# EAGLE design Base-Rev0 (EAGLE 7.7.0)
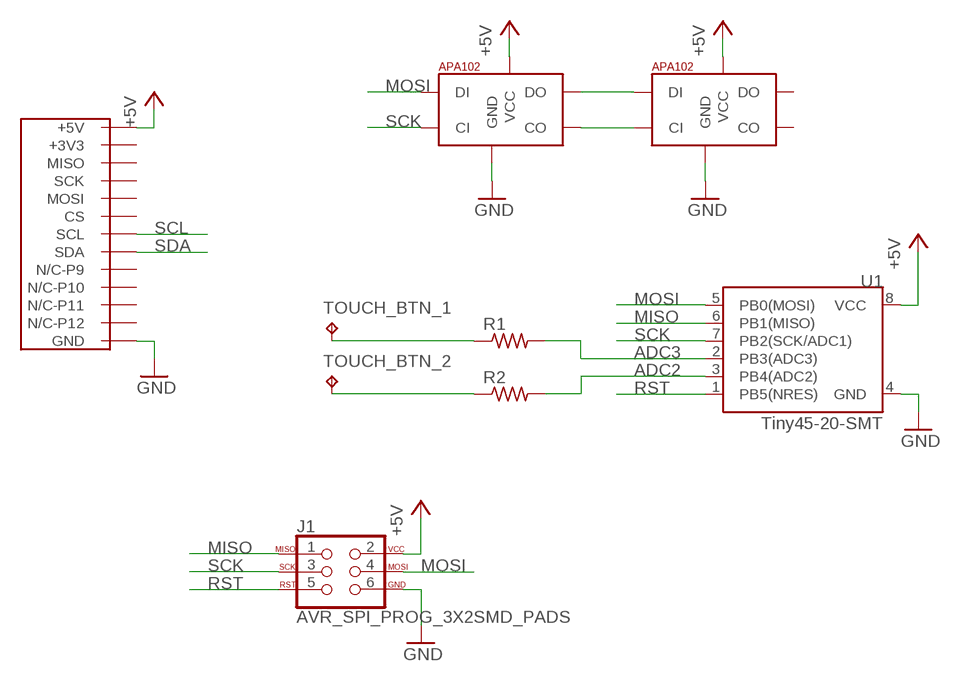
[diagram p0: schematic, sheet 1]

## Parts
J1  AVR_SPI_PROG_3X2SMD_PADS  [2X3-SMD-PADS]
R1  R-US_M0805  [M0805]
R2  R-US_M0805  [M0805]
TOUCH_BTN_1  TPTP06R  [TP06R]
TOUCH_BTN_2  TPTP06R  [TP06R]
U1  Tiny45-20-SMT  ATTINY45TINY45-20-SMT  [SO08-EIAJ_MCU]
U2  APA1025050  [APA102_5050]
U3  APA1025050  [APA102_5050]
U$1  BADGE64EXAMPLE  [BADGE64-MINIBADGE]

## Nets
+5V: J1.2 U1.8(VCC) U2.1(VCC) U3.1(VCC) U$1.+5V
ADC2: R2.2 U1.3(PB4(ADC2))
ADC3: R1.2 U1.2(PB3(ADC3))
BTN2: R2.1 TOUCH_BTN_2.TP
GND: J1.6 U1.4(GND) U2.6(GND) U3.6(GND) U$1.GND-P2(GND) U$1.GND-P8(GND) U$1.GND-P16(GND)
MISO: J1.1 U1.6(PB1(MISO))
MOSI: J1.4 U1.5(PB0(MOSI)) U2.4(DI)
N$1: U2.2(CO) U3.5(CI)
N$2: U2.3(DO) U3.4(DI)
N$4: R1.1 TOUCH_BTN_1.TP
RST: J1.5 U1.1(PB5(NRES))
SCK: J1.3 U1.7(PB2(SCK/ADC1)) U2.5(CI)
SCL: U$1.SCL
SDA: U$1.SDA
Unconnected: U3.2(CO) U3.3(DO) U$1.CS U$1.MISO U$1.MOSI U$1.NC-P9(N/C-P9) U$1.NC-P10(N/C-P10) U$1.NC-P11(N/C-P11) U$1.NC-P12(N/C-P12) U$1.SCK

## Power pins joined to a net without a drawn wire
+3V3: U$1.+3V3-P7(+3V3) U$1.+3V3-P15(+3V3)

## Library data of the parts
J1 = SparkFun-Connectors:AVR_SPI_PROG_3X2: AVR ISP 6 Pin This is the reduced ISP connector for AVR programming. Common on Arduino. This footprint will take up less PCB space and can be used with a 10-pin to 6-pin adapter such as SKU: BOB-08508 **Special note about "TEST_POINT" package. The stop mask is on the top side, so if you want your programming test points to be on the bottom of your board, make sure to place this package on the bottom side of the board. This also ensure that the orientation to program from the bottom side will be correct. SparkFun Products: SparkFun ISP Pogo Adapter <https://www.sparkfun.com/products/11591> - NS Tiny AVR Programmer <https://www.sparkfun.com/products/11801> -PTH
R1 R2 = resistor:R-US_: RESISTOR, American symbol
TOUCH_BTN_1 TOUCH_BTN_2 = testpad:TP: Test pad
U1 = SparkFun-Retired:ATTINY45: Atmel 8-pin 2/4/8kB flash uC Retired; PROD_ID: IC-08922
U2 U3 = jos-ph:APA102: APA102C 5050 RGB LED -- Adafruit DotStar Single LED Pixel Product Page: https://www.adafruit.com/products/2343 Datasheet: https://cdn-shop.adafruit.com/product-files/2343/APA102C.pdf
U$1 = MiniBadge:BADGE64

## Board
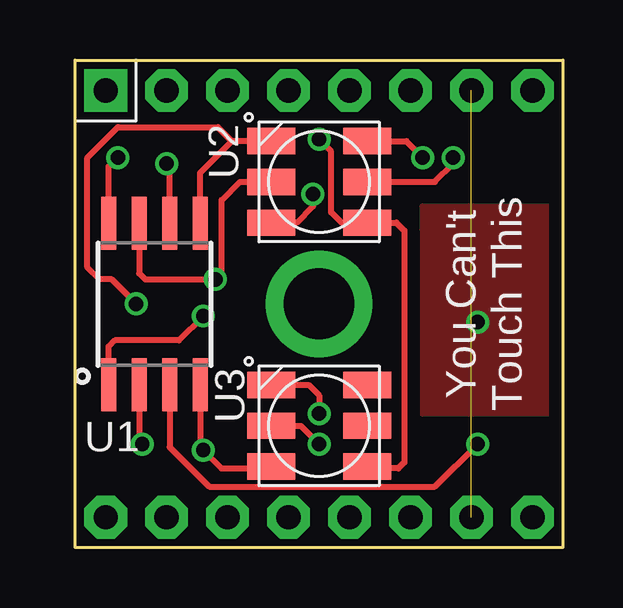
[diagram p1: board, top side]
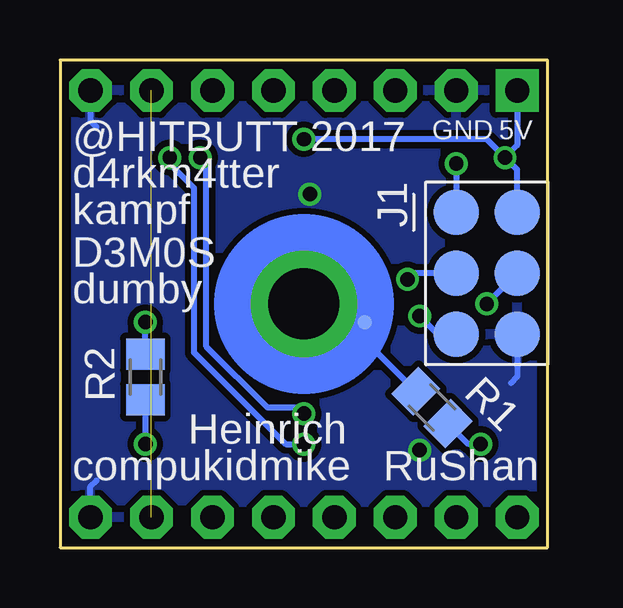
[diagram p2: board, bottom side, seen from below]

Size 20.32 x 20.32 mm. Coordinates in mm from the lower left corner, seen from the top.
Outline: 0,0 20.3,0 20.32,20.32 0,20.32 0,0
Copper layers (1*16): Top 0.0356mm / dielectric 1.5011mm / Bottom 0.0356mm
Design rules "oshpark-2layer *": minimum track width 6mil, minimum drill 13mil, track to track 6mil, track to pad 6mil, pad to pad 6mil, via to via 6mil, smd to smd 6mil, copper to edge 15mil, drill to drill 6mil, minimum pad ring 7mil, minimum via ring 7mil, stop-mask expansion 2.5mil, vias tented up to drill 25mil, thermal gap 10mil
bRestrict: area 7.7,7.7 to 12.6,12.6

### Footprints (pad centres in the part's own frame; a part is rotated, then mirrored left to right if it is on the bottom)
2X3-SMD-PADS = smd 1.905 x 1.905: 1 -2.54,-1.27; 2 -2.54,1.27; 3 0,-1.27; 4 0,1.27; 5 2.54,-1.27; 6 2.54,1.27
M0805 = smd 1.3 x 1.6: 1 -0.95,0; 2 0.95,0
TP06R = smd 0.6 x 0.6: TP 0,0
SO08-EIAJ_MCU = smd 0.61 x 2.21: 1 -1.905,-3.378; 2 -0.635,-3.378; 3 0.635,-3.378; 4 1.905,-3.378; 5 1.905,3.353; 6 0.635,3.353; 7 -0.635,3.353; 8 -1.905,3.353
APA102_5050 = smd 2 x 1.1: 1 2,-1.7; 2 2,0; 3 2,1.7; 4 -2,1.7; 5 -2,0; 6 -2,-1.7
BADGE64-MINIBADGE = drill 1.016 pad 1.778 octagon: +3V3-P7 16.51,19.05; +3V3-P15 16.51,1.27; CS 13.97,19.05; GND-P2 3.81,19.05; GND-P8 19.05,19.05; GND-P16 19.05,1.27; MISO 6.35,19.05; MOSI 11.43,19.05; NC-P9 1.27,1.27; NC-P10 3.81,1.27; NC-P11 6.35,1.27; NC-P12 8.89,1.27; SCK 8.89,19.05; SCL 11.43,1.27; SDA 13.97,1.27 | drill 1.016 pad 1.778 square: +5V 1.27,19.05

### Placement (x,y rotation side)
J1  2.54,11.43 270 bottom
R1  4.83,5.84 315 bottom
R2  16.76,7.11 270 bottom
TOUCH_BTN_1  7.62,9.4 0 bottom
TOUCH_BTN_2  16.76,9.4 0 bottom
U1  3.3,10.16 0 top
U2  10.16,15.24 0 top
U3  10.16,5.08 0 top
U$1  0,0 0 top

### Tracks (layer width: path | path; a pad name or v marks a point on that pad's centre or on a via)
+3V3  (1 unrouted)
+5V  (via drill 0.6)
  Top 0.254: U3.1 12.24,3.3 13.46,3.3 13.72,3.56 13.72,13.21 13.38,13.54 U2.1 11.1,13.54 10.67,13.97 10.67,16.51 v10.16,17.02 | U1.8 1.4,15.88 v1.78,16.26
  Bottom 0.254: J1.2 1.27,15.75 v1.78,16.26 | v1.78,16.26 2.54,17.02 v10.16,17.02 | U$1.+5V 1.27,16.76 v1.78,16.26
ADC2  (via drill 0.6)
  Top 0.254: v16.76,4.32 14.99,2.54 5.59,2.54 3.94,4.19 U1.3
  Bottom 0.254: R2.2 v16.76,4.32
ADC3  (via drill 0.6)
  Top 0.254: U1.2 2.67,4.45 v2.79,4.32
  Bottom 0.254: v2.79,4.32 3.3,4.32 R1.2
BTN2  (via drill 0.6)
  Bottom 0.254: R2.1 TOUCH_BTN_2.TP
  other vias: 16.76,9.4
  pour Top (isolate 0.508): 14.48,14.22 19.81,14.22 19.81,5.59 14.48,5.59
GND  (via drill 0.6)
  Top 0.254: U1.4 5.21,4.45 v5.33,4.06 6.1,3.3 8.08,3.3 U3.6 | U2.6 9.22,13.54 9.91,14.22 v9.91,14.73
  Bottom 0.254: U$1.GND-P16 19.05,2.54 18.8,2.79 | U$1.GND-P8 19.05,17.78 18.8,17.53 | J1.6 1.27,7.11 1.52,6.86
  pour Bottom (isolate 0.254): 0,20.32 20.32,20.32 20.32,0 0,0
MISO  (via drill 0.6)
  Top 0.254: U1.6 3.94,15.88 v3.81,16
  Bottom 0.254: v3.81,16 J1.1
MOSI  (via drill 0.6)
  Top 0.254: 6.53,16.94 5.21,15.62 U1.5 | U2.4 6.53,16.94 | v2.54,10.16 1.52,11.18 1.02,11.18 0.51,11.68 0.51,16.26 1.78,17.53 5.94,17.53 6.53,16.94
  Bottom 0.254: J1.4 v2.54,10.16
N$1  (via drill 0.6)
  Top 0.254: U2.2 14.99,15.24 15.75,16 v15.75,16.26 | U3.5 9.4,5.08 v10.16,4.32
  Bottom 0.254: v15.75,16.26 15.75,16 14.73,14.99 14.73,8.13 10.92,4.32 v10.16,4.32
N$2  (via drill 0.6)
  Top 0.254: U2.3 13.79,16.94 v14.48,16.26 | U3.4 9.73,6.78 10.16,6.35 v10.16,5.59
  Bottom 0.254: v14.48,16.26 14.22,16 14.22,8.38 11.68,5.84 10.41,5.84 v10.16,5.59
N$4
  Bottom 0.254: R1.1 | R1.1 7.62,8.64 TOUCH_BTN_1.TP
N$5  (via drill 2.95 pad 4.45)
  other vias: 10.16,10.16
RST  (via drill 0.6)
  Top 0.254: v5.33,9.65 4.32,8.64 1.65,8.64 1.4,8.38 U1.1
  Bottom 0.254: J1.5 4.57,8.89 v5.33,9.65
SCK  (via drill 0.6)
  Top 0.254: U2.5 6.86,15.24 6.1,14.48 6.1,11.43 v5.84,11.18 2.92,11.18 2.67,11.43 U1.7
  Bottom 0.254: J1.3 5.59,11.43 v5.84,11.18
(copper drawn outside any net)
  shapes: Bottom circle x1

### Text on the board
tPlace: You Can't / Touch This
bPlace: 5V | GND | @HITBUTT 2017 | d4rkm4tter | kampf | D3M0S | dumby | Heinrich | RuShan | compukidmike
Reference: ø0.116